# Altium schematic sheet LCD.SchDoc
size A4; SheetNumber: 5; SheetTotal: 5
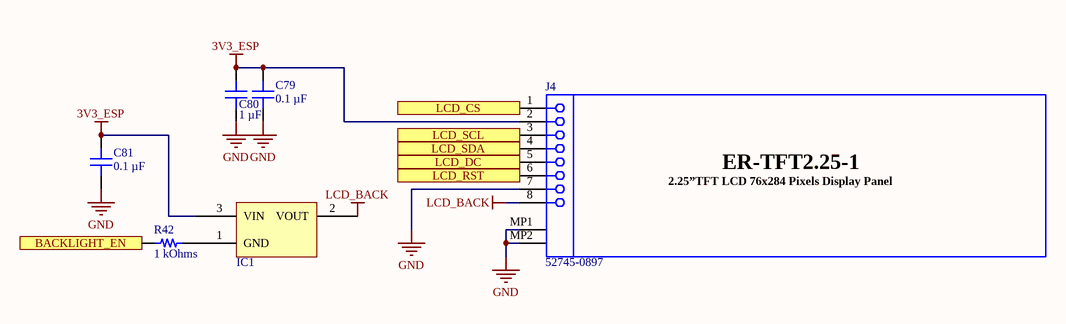
[diagram p0: LCD.SchDoc]

## Parts
C79  0.1 µF  [CAP 0603_1608]
C80  1 µF  [CAP 0603_1608]
C81  0.1 µF  [CAP 0603_1608]
IC1  Taken From Chinese PCB  [DIODES SOT-23-3]  (value not drawn)
J4  52745-0897  [MOLX-52745-0897]
R42  1 kOhms  [RES 0603_1608]

## Ports
BACKLIGHT_EN, LCD_CS, LCD_DC, LCD_RST, LCD_SCL, LCD_SDA

## Nets
3V3_ESP: C79.2 C80.2 C81.2 IC1.3(VIN) J4.2
GND: C79.1 C80.1 C81.1 J4.7 J4.MP1 J4.MP2
LCD_BACK: IC1.2(VOUT) J4.8
BACKLIGHT_EN: R42.2 ; port BACKLIGHT_EN
LCD_CS: J4.1 ; port LCD_CS
LCD_DC: J4.5 ; port LCD_DC
LCD_RST: J4.6 ; port LCD_RST
LCD_SCL: J4.3 ; port LCD_SCL
LCD_SDA: J4.4 ; port LCD_SDA
NetIC1_1: IC1.1(GND) R42.1

## Notes on the sheet
- (in symbol 52745-0897) ER-TFT2.25-1; 2.25”TFT LCD 76x284 Pixels Display Panel

## Library data of the parts
C79 C81 = C0603C104M5RACTU: SMT Capacitor; manufacturer: KEMET; Temperature Coefficient: X7R; Tolerance: ±20%; Voltage - Rated: 50V; Part Number: C0603C104M5RACTU; value: 0.1 µF; Applications: Bypass, Decoupling; Capacitance: 0.1 µF; componentlink1description: Datasheet; componentlink1url: https://api.kemet.com/component-edge/download/datasheet/C0603C104M5RACTU.pdf; componentlink2description: DigiKey Link; componentlink2url: https://www.digikey.com/en/products/detail/kemet/C0603C104M5RACTU/2199782; Device Package: 0603 (1608 Metric); lastupdated: 06/04/2026 19:22:47; Lifecycle Status: Active; Minimum Order: 1; Mounting Type: Surface Mount, MLCC; Operating Temperature: -55°C ~ 125°C; Package / Case: 0603 (1608 Metric); packaging: CutTape; partid: 69106; Part Status: Active; price: 0.01; series: SMD Comm X7R; Size / Dimension: 0.063" L x 0.031" W (1.60mm x 0.80mm); Supplier 1: DigiKey; Supplier Part Number 1: 399-C0603C104M5RACTUCT-ND; Thickness (Max): 0.034" (0.87mm)
C80 = GMC10X7R105M50NT: SMT Capacitor; manufacturer: Cal-Chip Electronics, Inc.; Temperature Coefficient: X7R; Tolerance: ±20%; Voltage - Rated: 50V; Part Number: GMC10X7R105M50NT; Applications: General Purpose; Capacitance: 1 µF; componentlink1description: Datasheet; componentlink1url: https://calchip.com/wp-content/uploads/2024/02/gmc_series-1.pdf; componentlink2description: DigiKey Link; componentlink2url: https://www.digikey.com/en/products/detail/cal-chip-electronics-inc/GMC10X7R105M50NT/25323876; Device Package: 0603 (1608 Metric); lastupdated: 06/04/2026 19:17:52; Lifecycle Status: Active; Minimum Order: 1; Mounting Type: Surface Mount, MLCC; Operating Temperature: -55°C ~ 125°C; Package / Case: 0603 (1608 Metric); packaging: TapeAndReel; partid: 65934; price: 0.06; series: GMC; Size / Dimension: 0.063" L x 0.031" W (1.60mm x 0.80mm); Supplier 1: DigiKey; Supplier Part Number 1: 4713-GMC10X7R105M50NTCT-ND; Thickness (Max): 0.037" (0.95mm); value: 1 µF
IC1 = AP7313-15SRG-7: IC REG LINEAR LED DRIVER 60mA; Manufacturer: Diodes Incorporated; Current - Quiescent (Iq): 75 µA; Current - Supply (Max): 85 µA; Number of Regulators: 1; Output Configuration: Positive; Output Type: Fixed; Protection Features: Over Current, Over Temperature, Short Circuit; PSRR: 65dB (100Hz); Voltage - Input (Max): 6V; Voltage - Output (Min/Fixed): 1.5V; Part Number: Taken From Chinese PCB; ComponentLink1Description: Datasheet; ComponentLink1URL: https://www.diodes.com/assets/Datasheets/AP7313.pdf; ComponentLink2Description: DigiKey Link; ComponentLink2URL: https://www.digikey.com/en/products/detail/diodes-incorporated/AP7313-15SRG-7/4249709; Current - Output: 60mA; LastUpdated: 05/04/2026 20:53:04; Lifecycle Status: Active; Minimum Order: 1; Mounting Type: Surface Mount; Operating Temperature: -40°C ~ 85°C; Packaging: TapeAndReel; Price: 0.09; Series: -; Supplier 1: DigiKey; Supplier Part Number 1: 31-AP7313-15SRG-7CT-ND; Supplier Device Package: SOT23R
J4 = 52745-0897: 0.5 mm Pitch Easy-On(TM) Type FPC Connector, 2.0 mm Mated Height, Right Angle, ZIF, SMT, Top Contact, 8 Circuits, -20 to 85 degC, ELV and RoHS Compliant, Tape and Reel; Manufacturer: Molex; Material - Plating Mating: Gold; Stackable: No; Material - Metal: Phosphor Bronze; PCB Retention: Yes; Mated Height: 2.00mm; Durability (mating cycles max): 20; Circuits (Loaded): 8; Current (Max per Contact): 0.5A; Pitch - Mating Interface: 0.50mm; Voltage (Max): 50V; Entry Angle: 90degrees Angle; Mounting Technology: Surface Mount; Packing: Tape and Reel; ComponentLink3URL: http://www.molex.com/pdm_docs/sd/527450897_sd.pdf; ComponentLink2URL: http://www.molex.com/webdocs/datasheets/pdf/en-us/0527450897_FFC_FPC_CONNECTORS.pdf; PackageVersion: Rev. C, 07/2010; PackageReference: 52745-0897; Contact Position: Top; Orientation: Right Angle; ComponentLink1Description: Manufacturer URL; ComponentLink2Description: Datasheet; Material - Plating Termination: Gold; PartNumber: 52745-0897; Number of Rows: 1; PackageDescription: 8-Lead FPC Connector, Pitch 0.5 mm; ComponentLink3Description: Package Specification; ComponentLink1URL: http://www.molex.com/molex/index.jsp; Polarized to PCB: Yes; PCB Locator: No; RoHS: TRUE
R42 = ERJ-PA3F1001V: RES SMD 1K OHM 1% 1/3W 0603; Manufacturer: Panasonic Electronic Components; Power (Watts): 0.333W 1/3W; Temperature Coefficient: ±100ppm/°C; ComponentLink1Description: Datasheet; ComponentLink1URL: https://industrial.panasonic.com/cdbs/www-data/pdf/RDO0000/AOA0000C331.pdf; ComponentLink2Description: DigiKey Link; ComponentLink2URL: https://www.digikey.com/en/products/detail/panasonic-electronic-components/ERJ-PA3F1001V/5035848; Composition: Thick Film; Device Package: 0603 (1608 Metric); Features: Automotive AEC-Q200 Pulse Withstanding; Height - Seated (Max): 0.022\ (0.55mm); LastUpdated: 2024-02-09 20:42:57.220000; Lifecycle Status: Active; Part Number: ERJ-PA3F1001V; Minimum Order: 1; Number of Terminations: 2; Operating Temperature: -55°C ~ 155°C; Package / Case: 0603 (1608 Metric); Packaging: TapeAndReel; PartId: 14885; Part Status: Active; Price: 0.01; Ratings: AEC-Q200; Resistance: 1 kOhms; Series: ERJ-PA3; Size / Dimension: 0.063\ L x 0.031\ W (1.60mm x 0.80mm); Supplier 1: DigiKey; Supplier Part Number 1: P1.0KBYCT-ND; Supplier Device Package: 0603; Tolerance: ±1%; Value: 1 kOhms